# EAGLE design pcbremote (EAGLE 9.6.2)
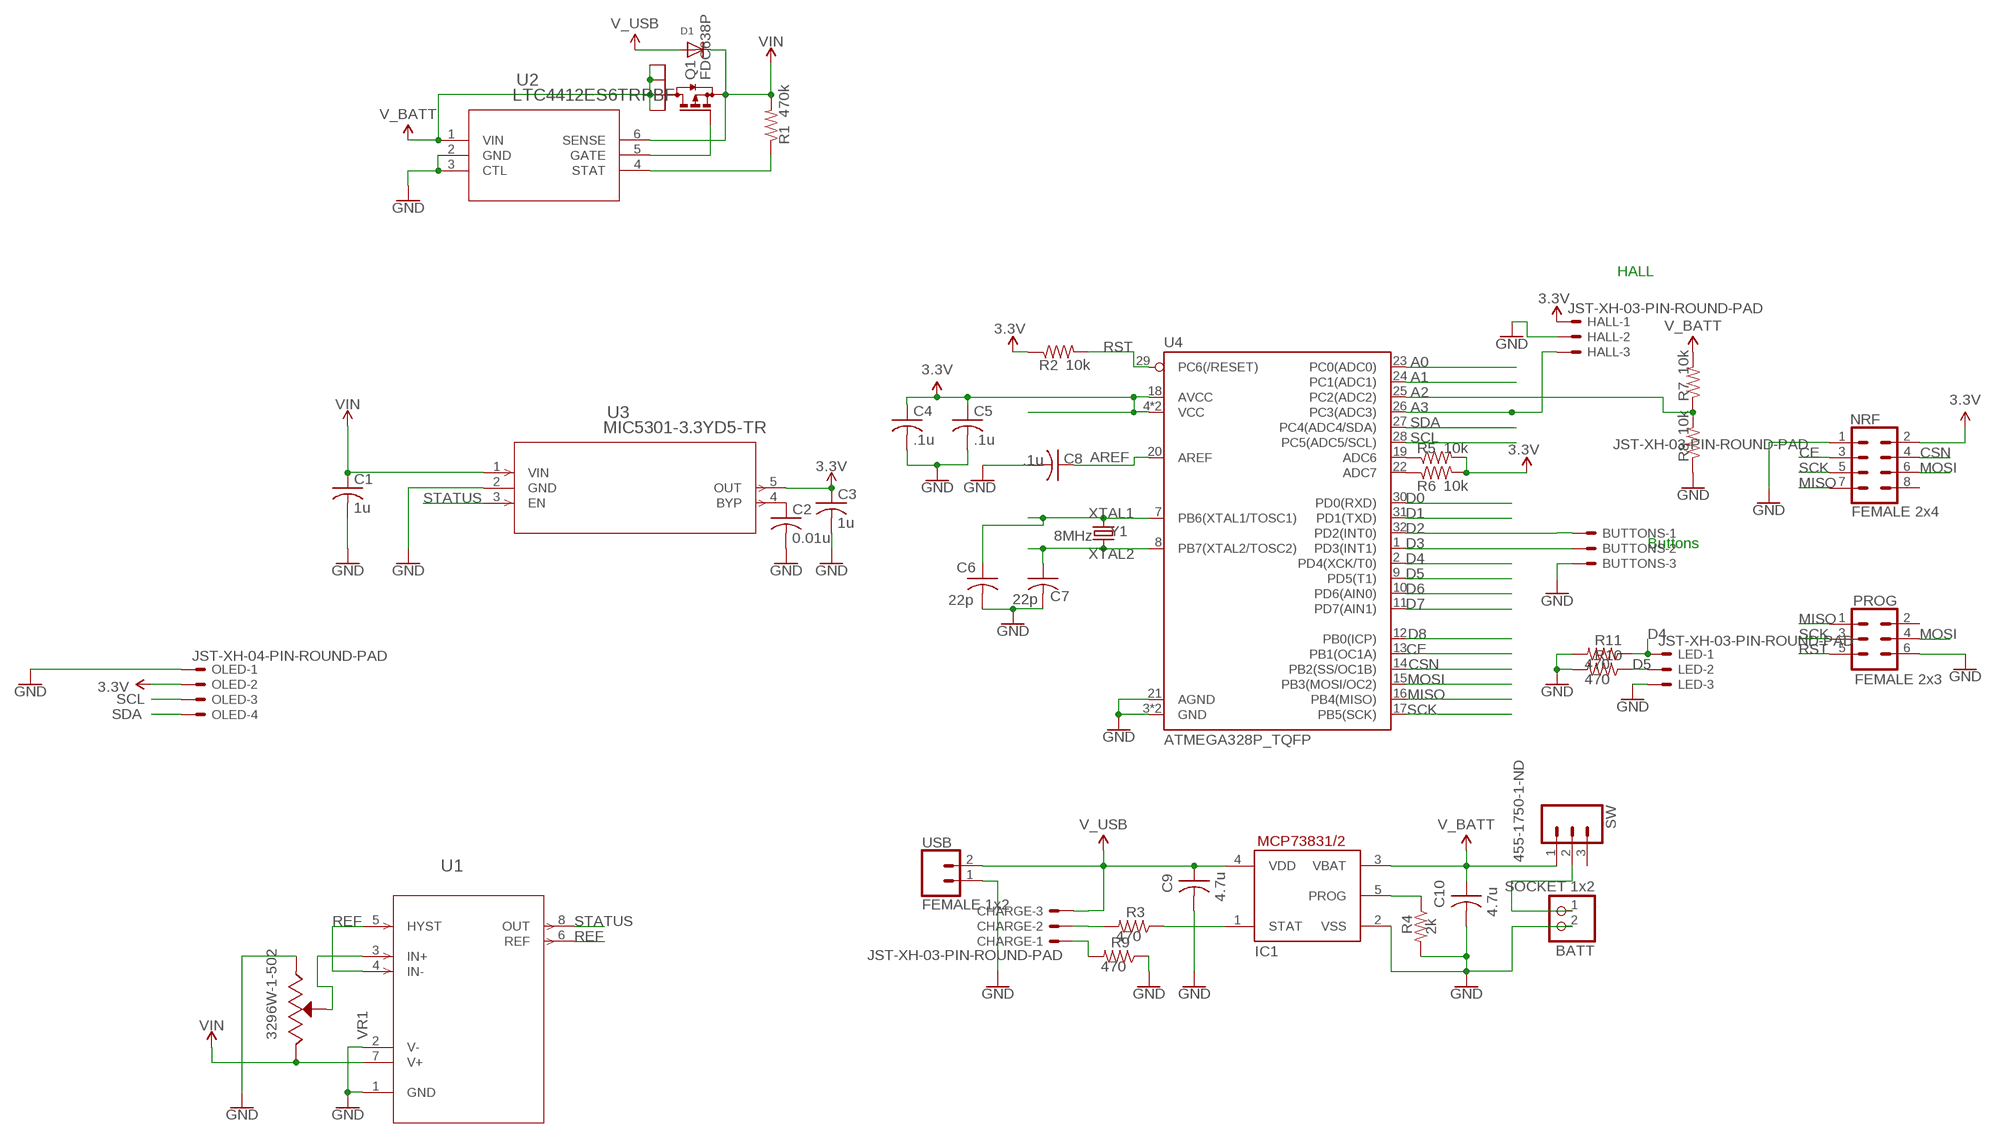
[diagram p0: schematic, sheet 1]

## Parts
BATT  SOCKET 1x2  JST_2PIN-THM  [JST-PH-2-THM]
BUTTONS  JST-XH-03-PIN-ROUND-PAD  [JST-XH-03-PACKAGE-ROUND-PAD]
C1  1u  C-USC0805  [C0805]
C2  0.01u  C-USC0805  [C0805]
C3  1u  C-USC0805  [C0805]
C4  .1u  C-USC0805  [C0805]
C5  .1u  C-USC0805  [C0805]
C6  22p  C-USC0805  [C0805]
C7  22p  C-USC0805  [C0805]
C8  .1u  C-USC0805  [C0805]
C9  4.7u  C-USC0805  [C0805]
C10  4.7u  C-USC0805  [C0805]
CHARGE  JST-XH-03-PIN-ROUND-PAD  [JST-XH-03-PACKAGE-ROUND-PAD]
D1  DIODESOD-123  [SOD-123]
HALL  JST-XH-03-PIN-ROUND-PAD  [JST-XH-03-PACKAGE-ROUND-PAD]
IC1  MCP73831/OT  [SOT23-5L]
LED  JST-XH-03-PIN-ROUND-PAD  [JST-XH-03-PACKAGE-ROUND-PAD]
NRF  FEMALE 2x4  CONN_04X2  [2X4]
OLED  JST-XH-04-PIN-ROUND-PAD  [JST-XH-04-PACKAGE-ROUND-PAD]
PROG  FEMALE 2x3  CONN_03X2FEMALE  [2X3]
Q1  FDC638P  [SSOT-6]
R1  470k  R-US_R0805  [R0805]
R2  10k  R-US_R0805  [R0805]
R3  470  R-US_R0805  [R0805]
R4  2k  R-US_R0805  [R0805]
R5  10k  R-US_R0805  [R0805]
R6  10k  R-US_R0805  [R0805]
R7  10k  R-US_R0805  [R0805]
R8  10k  R-US_R0805  [R0805]
R9  470  R-US_R0805  [R0805]
R10  470  R-US_R0805  [R0805]
R11  470  R-US_R0805  [R0805]
SW  455-1750-1-ND  CONN_03  [1X03]
U1  LTC1540CS8PBF  [SO-8_S_LIT]
U2  LTC4412ES6TRPBF  [TSOT-23_S6_LIT]
U3  MIC5301-3.3YD5-TR  [TSOT-23-5_D5_MCH]
U4  ATMEGA328P_TQFP  [TQFP32-08]
USB  FEMALE 1x2  CONN_02  [1X02]
VR1  3296W-1-502  [TRIM_3296W-1-502]
Y1  8MHz  CRYSTAL-8MHZSMD-5X3.2  [CRYSTAL-SMD-5X3.2-4PAD]

## Nets
3.3V: C3.1 C4.1 C5.1 HALL.1 NRF.2 OLED.2 R2.1 R5.2 R6.2 U3.5(OUT) U4.4(VCC) U4.6(VCC) U4.18(AVCC)
A0: U4.23(PC0(ADC0))
A1: U4.24(PC1(ADC1))
A2: R7.1 R8.2 U4.25(PC2(ADC2))
A3: HALL.3 U4.26(PC3(ADC3))
AREF: C8.1 U4.20(AREF)
CE: NRF.3 U4.13(PB1(OC1A))
CSN: NRF.4 U4.14(PB2(SS/OC1B))
D0: U4.30(PD0(RXD))
D1: U4.31(PD1(TXD))
D2: BUTTONS.1 U4.32(PD2(INT0))
D3: BUTTONS.2 U4.1(PD3(INT1))
D4: LED.1 R11.1 U4.2(PD4(XCK/T0))
D5: LED.2 R10.1 U4.9(PD5(T1))
D6: U4.10(PD6(AIN0))
D7: U4.11(PD7(AIN1))
D8: U4.12(PB0(ICP))
GND: BATT.2 BUTTONS.3 C1.2 C2.2 C3.2 C4.2 C5.2 C6.2 C7.2 C8.2 C9.2 C10.2 HALL.2 IC1.2(VSS) LED.3 NRF.1 OLED.1 PROG.6 R4.2 R8.1 R9.1 R10.2 R11.2 U1.1(GND) U1.2(V-) U2.2(GND) U2.3(CTL) U3.2(GND) U4.3(GND) U4.5(GND) U4.21(AGND) USB.1 VR1.3(CW)
MISO: NRF.7 PROG.1 U4.16(PB4(MISO))
MOSI: NRF.6 PROG.4 U4.15(PB3(MOSI/OC2))
N$1: U1.3(IN+) VR1.2(WIPER)
N$2: CHARGE.1 R9.2
N$3: IC1.5(PROG) R4.1
N$4: IC1.1(STAT) R3.1
N$5: CHARGE.2 R3.2
N$6: R5.1 U4.19(ADC6)
N$7: R6.1 U4.22(ADC7)
N$8: C2.1 U3.4(BYP)
N$9: Q1.3(G) U2.5(GATE)
N$10: BATT.1 SW.2
N$13: R1.1 U2.4(STAT)
REF: U1.4(IN-) U1.5(HYST) U1.6(REF)
RST: PROG.5 R2.2 U4.29(PC6(/RESET))
SCK: NRF.5 PROG.3 U4.17(PB5(SCK))
SCL: OLED.3 U4.28(PC5(ADC5/SCL))
SDA: OLED.4 U4.27(PC4(ADC4/SDA))
STATUS: U1.8(OUT) U3.3(EN)
V_BATT: C10.1 IC1.3(VBAT) Q1.1(D4) Q1.2(D1) Q1.5(D2) Q1.6(D3) R7.2 SW.1 U2.1(VIN)
V_USB: C9.1 CHARGE.3 D1.A IC1.4(VDD) USB.2
VIN: C1.1 D1.C Q1.4(S) R1.2 U1.7(V+) U2.6(SENSE) U3.1(VIN) VR1.1(CCW)
XTAL1: C6.1 U4.7(PB6(XTAL1/TOSC1)) Y1.1
XTAL2: C7.1 U4.8(PB7(XTAL2/TOSC2)) Y1.3
Unconnected: NRF.8 PROG.2 SW.3

## Notes on the sheet
- HALL
- Buttons

## Library data of the parts
BATT = adafruit:JST_2PIN: JST 2-Pin Connectors of various flavors SMT-RA (S2B-PH-SM4) 4UConnector #17311 SMT (B2B-PH-SM4) THM-RA (S2B-PH) THM (B2B-PH)
BUTTONS CHARGE HALL LED = Rembrandt Electronics - JST XH Connectors v1-0:JST-XH-03-PIN: JST XH Connector 2 Pin Wire to board connector. Pitch: 2,54 mm, (0.100") Number of pins: 3 Created by Rembrandt Electronics www.rembrandtelectronics.com
C1-C10 = rcl:C-US: CAPACITOR, American symbol; SPICEPREFIX: C
D1 = adafruit:DIODE: Diode SMADIODE - SMA Surface Mount Package 20V 1A Schottky Diode Digikey: 641-1014-6-ND DO-1N4148 - Through Hole Small Current Diode SOD-123 20V 1 A (.5mV Vf) Schottky Diode - Digikey: MBRX120TPMSCT-ND SOD-323 10V 570mA (.38mV Vf, 3ns) Schottky Diode - Digikey: ZLLS410CT-ND SOD-523 30V 30mA Schottky Diode (RB751S-40TE61) - Digikey: RB751S-40TE61CT-ND SOT23-R/W - SOT23 Package (R = Solder Paste/Reflow Ovens, W = Hand-Soldering) BAT54Film 40V 300mA - Digikey: 497-7162-1-ND
IC1 = adafruit:MCP73831: MCP73831/2 Miniature Single-Cell, Fully Integrated Li-Ion, Li-Polymer Charge Management Controllers. Nice and small simple lipoly charge controller, with adjustable current and status output (LED) http://www.ladyada.net/library/pcb/eaglelibrary.html
NRF = SparkFun-Connectors:CONN_04X2: Multi connection point. Often used as Generic Header-pin footprint for 0.1 inch spaced/style header connections On any of the 0.1 inch spaced packages, you can populate with these: Break Away Headers - Straight <https://www.sparkfun.com/products/116> (PRT-00116) Break Away Male Headers - Right Angle <https://www.sparkfun.com/products/553> (PRT-00553) Female Headers <https://www.sparkfun.com/products/115> (PRT-00115) Break Away Headers - Machine Pin <https://www.sparkfun.com/products/117> (PRT-00117) Break Away Female Headers - Swiss Machine Pin <https://www.sparkfun.com/products/743> (PRT-00743)
OLED = Rembrandt Electronics - JST XH Connectors v1-0:JST-XH-04-PIN: JST XH Connector 2 Pin Wire to board connector. Pitch: 2,54 mm, (0.100") Number of pins: 4 Created by Rembrandt Electronics www.rembrandtelectronics.com
PROG = SparkFun-Connectors:CONN_03X2: Multi connection point. Often used as Generic Header-pin footprint for 0.1 inch spaced/style header connections You can populate with any combo of single row headers, but if you'd like an exact match, check these: Header - 2x3 (Male, 0.1") <https://www.sparkfun.com/products/12807> (PRT-12807) Header - 2x3 (Female, 0.1") <https://www.sparkfun.com/products/13010> (PRT-13010) 2x3 Pin Shrouded Header <https://www.sparkfun.com/products/10877> (PRT-10877) On any of the 0.1 inch spaced packages, you can populate with these: Break Away Headers - Straight <https://www.sparkfun.com/products/116> (PRT-00116) Break Away Male Headers - Right Angle <https://www.sparkfun.com/products/553> (PRT-00553) Female Headers <https://www.sparkfun.com/products/115> (PRT-00115) Break Away Headers - Machine Pin <https://www.sparkfun.com/products/117> (PRT-00117) Break Away Female Headers - Swiss Machine Pin <https://www.sparkfun.com/products/743> (PRT-00743) Special note: the shrouded connector mates well with our 3x2 ribbon cables: Ribbon Crimp Connector - 6-pin (2x3, Female) <https://www.sparkfun.com/products/10651> (PRT-10651) Ribbon Cable - 6 wire (15ft) <https://www.sparkfun.com/products/10646> (PRT-10646); PROD_ID: CONN-11566
Q1 = FDC638P:FDC638P; DESCRIPTION: P-Channel 20V 4.5A (Ta) 1.6W (Ta) Surface Mount SuperSOT™-6; DIGI-KEY_PART_NUMBER: FDC638PCT-ND; MF: ON Semiconductor; MP: FDC638P; PACKAGE: TSOT-23-6 ON Semiconductor
R1-R11 = rcl:R-US_: RESISTOR, American symbol; SPICEPREFIX: R
SW = SparkFun-Connectors:CONN_03: Multi connection point. Often used as Generic Header-pin footprint for 0.1 inch spaced/style header connections On any of the 0.1 inch spaced packages, you can populate with these: Break Away Headers - Straight <https://www.sparkfun.com/products/116> (PRT-00116) Break Away Male Headers - Right Angle <https://www.sparkfun.com/products/553> (PRT-00553) Female Headers <https://www.sparkfun.com/products/115> (PRT-00115) Break Away Headers - Machine Pin <https://www.sparkfun.com/products/117> (PRT-00117) Break Away Female Headers - Swiss Machine Pin <https://www.sparkfun.com/products/743> (PRT-00743) Stackable Header - 3 Pin (Female, 0.1") <https://www.sparkfun.com/products/13875> (PRT-13875) For SCREWTERMINALS and SPRING TERMINALS visit here: Screw Terimnals on SparkFun.com <https://www.sparkfun.com/search/results?term=Screw+Terminals> (5mm/3.5mm/2.54mm spacing) This device is also useful as a general connection point to wire up your design to another part of your project. Our various solder wires solder well into these plated through hole pads. Hook-Up Wire - Assortment (Stranded, 22 AWG) <https://www.sparkfun.com/products/11375> (PRT-11375) Hook-Up Wire - Assortment (Solid Core, 22 AWG) <https://www.sparkfun.com/products/11367> (PRT-11367) View the entire wire category on our website here <https://www.sparkfun.com/categories/141> Special notes: Molex polarized connector foot print use with SKU : PRT-08232 with associated crimp pins and housings.; PROD_ID: XXX-00000
U1 = LTC_1450:LTC1540CS8PBF; BUILT_BY: EMA_UL_Team; MANUFACTURER_PART_NUMBER: ltc1540cs8#pbf; SOURCELIBRARY: LinearTech_2016_03_08; VENDOR: Linear Technology
U2 = LTC4412:LTC4412ES6TRPBF; BUILT_BY: EMA_UL_Team; MANUFACTURER_PART_NUMBER: LTC4412ES6#TRPBF; SOURCELIBRARY: LinearTech_2016-05-13_1; VENDOR: Linear Technology
U3 = MIC5301:MIC5301-3.3YD5-TR; BUILT_BY: EMA_Jessica; COPYRIGHT: Copyright (C) 2018 Accelerated Designs. All rights reserved; MANUFACTURER_PART_NUMBER: MIC5301-3.3YD5-TR; SOURCELIBRARY: Microchip_2019-08-23_3; VENDOR: Microchip
U4 = SparkFun-IC-Microcontroller:ATMEGA328P_TQFP: Popular 328P in QFP Storefront component: ATmega328 - TQFP <https://www.sparkfun.com/products/13448> (COM-13448) Datasheet <http://www.sparkfun.com/datasheets/Components/SMD/ATMega328.pdf> SparkFun Products SparkFun RedBoard - Programmed with Arduino <https://www.sparkfun.com/products/12757> (DEV-12757) Arduino Pro Mini 328 - 5V/16MHz <https://www.sparkfun.com/products/11113> (DEV-11113) Arduino Pro Mini 328 - 3.3V/8MHz <https://www.sparkfun.com/products/11114> (DEV-11114) SparkFun OpenLog <https://www.sparkfun.com/products/13712> (DEV-13712) SparkFun MicroView - OLED Arduino Module <https://www.sparkfun.com/products/12923> (DEV-12923) SparkFun Digital Sandbox <https://www.sparkfun.com/products/12651> (DEV-12651) SparkFun PicoBoard <https://www.sparkfun.com/products/11888> (WIG-11888) Arduino Fio <https://www.sparkfun.com/products/10116> (DEV-10116) LilyPad Arduino 328 Main Board <https://www.sparkfun.com/products/13342> (DEV-13342) SparkFun RedStick <https://www.sparkfun.com/products/13741> (DEV-13741) LilyPad MP3 <https://www.sparkfun.com/products/11013> (DEV-11013) LilyPad Arduino SimpleSnap <https://www.sparkfun.com/products/10941> (DEV-10941) SparkFun Stepoko <https://www.sparkfun.com/products/13899> (ROB-13899) SparkFun Geiger Counter <https://www.sparkfun.com/products/11345> (SEN-11345) SparkFun EL Sequencer <https://www.sparkfun.com/products/12781> (COM-12781) Arduino Pro 328 - 5V/16MHz <https://www.sparkfun.com/products/10915> (DEV-10915) CryptoCape <https://www.sparkfun.com/products/12773> (DEV-12773) SparkFun IR Thermometer Evaluation Board - MLX90614 <https://www.sparkfun.com/products/10740> (SEN-10740) SparkFun RedBot Mainboard <https://www.sparkfun.com/products/12097> (ROB-12097) Arduino Pro 328 - 3.3V/8MHz <https://www.sparkfun.com/products/10914> (DEV-10914) SparkFun Block for Intel® Edison - Arduino <https://www.sparkfun.com/products/13036> (DEV-13036) SparkFun Simon Says - Surface Mount Soldering Kit <https://www.sparkfun.com/products/10935> (KIT-10935) SparkFun 7-Segment Serial Display - Red <https://www.sparkfun.com/products/11441> (COM-11441) SparkFun 7-Segment Serial Display - White <https://www.sparkfun.com/products/11629> (COM-11629) SparkFun 7-Segment Serial Display - Yellow <https://www.sparkfun.com/products/11443> (COM-11443) SparkFun 7-Segment Serial Display - Kelly Green <https://www.sparkfun.com/products/11440> (COM-11440) SparkFun 7-Segment Serial Display - Blue <https://www.sparkfun.com/products/11442> (COM-11442) SparkFun OpenSegment Serial Display - 20mm (Blue) <https://www.sparkfun.com/products/11647> (COM-11647) SparkFun OpenSegment Serial Display - 20mm (Green) <https://www.sparkfun.com/products/11646> (COM-11646) SparkFun OpenSegment Serial Display - 20mm (White) <https://www.sparkfun.com/products/11648> (COM-11648) SparkFun OpenSegment Serial Display - 20mm (Red) <https://www.sparkfun.com/products/11644> (COM-11644) SparkFun OpenSegment Serial Display - 20mm (Yellow) <https://www.sparkfun.com/products/11645> (COM-11645) SparkFun OpenSegment Shield <https://www.sparkfun.com/products/13190> (DEV-13190); PROD_ID: IC-09069
USB = SparkFun-Retired:CONN_02: Multi connection point. Often used as Generic Header-pin footprint for 0.1 inch spaced/style header connections On any of the 0.1 inch spaced packages, you can populate with these: Break Away Headers - Straight <https://www.sparkfun.com/products/116> (PRT-00116) Break Away Male Headers - Right Angle <https://www.sparkfun.com/products/553> (PRT-00553) Female Headers <https://www.sparkfun.com/products/115> (PRT-00115) Break Away Headers - Machine Pin <https://www.sparkfun.com/products/117> (PRT-00117) Break Away Female Headers - Swiss Machine Pin <https://www.sparkfun.com/products/743> (PRT-00743) For SCREWTERMINALS and SPRING TERMINALS visit here: Screw Terimnals on SparkFun.com <https://www.sparkfun.com/search/results?term=Screw+Terminals> (5mm/3.5mm/2.54mm spacing) This device is also useful as a general connection point to wire up your design to another part of your project. Our various solder wires solder well into these plated through hole pads. Hook-Up Wire - Assortment (Stranded, 22 AWG) <https://www.sparkfun.com/products/11375> (PRT-11375) Hook-Up Wire - Assortment (Solid Core, 22 AWG) <https://www.sparkfun.com/products/11367> (PRT-11367) View the entire wire category on our website here <https://www.sparkfun.com/categories/141> Special notes: Molex polarized connector foot print use with: PRT-08233 with associated crimp pins and housings. 2.54_SCREWTERM for use with PRT-10571. 3.5mm Screw Terminal footprints for PRT-08084 5mm Screw Terminal footprints for use with PRT-08432
VR1 = 3296W-1-502:3296W-1-502: Res Cermet Trimmer 500K Ohm 10% 0.5W 25(Elec)Turn 2.19mm (9.53 X 4.83 X 11.55mm) Pin Thru-Hole Tube; DESCRIPTION: 5 kOhms 0.5W, 1/2W PC Pins Through Hole Trimmer Potentiometer Cermet 25 Turn Top Adjustment; DIGI-KEY_PART_NUMBER: 3296W-502LF-ND; MF: Bourns; MP: 3296W-1-502; PACKAGE: SOT-23-5 Bourns; PURCHASE-URL: https://pricing.snapeda.com/search/part/3296W-1-502/?ref=eda
Y1 = SparkFun-Clocks:CRYSTAL-8MHZ: 8MHz Crystal Datasheet Example <http://www.futureelectronics.com/en/technologies/electromechanical/timing-devices/crystals/Pages/6008189-ABM3B-8.000MHZ-B2-T.aspx?IM=0> Frequency: 8MHz Frequency Tolerance: ±20ppm Load Capacitance: 18pF SparkFun Products: Pro Micro -3.3V/8MHz <https://www.sparkfun.com/products/12587> WAV Trigger <https://www.sparkfun.com/products/13660>; PROD_ID: XTAL-09431

## Board
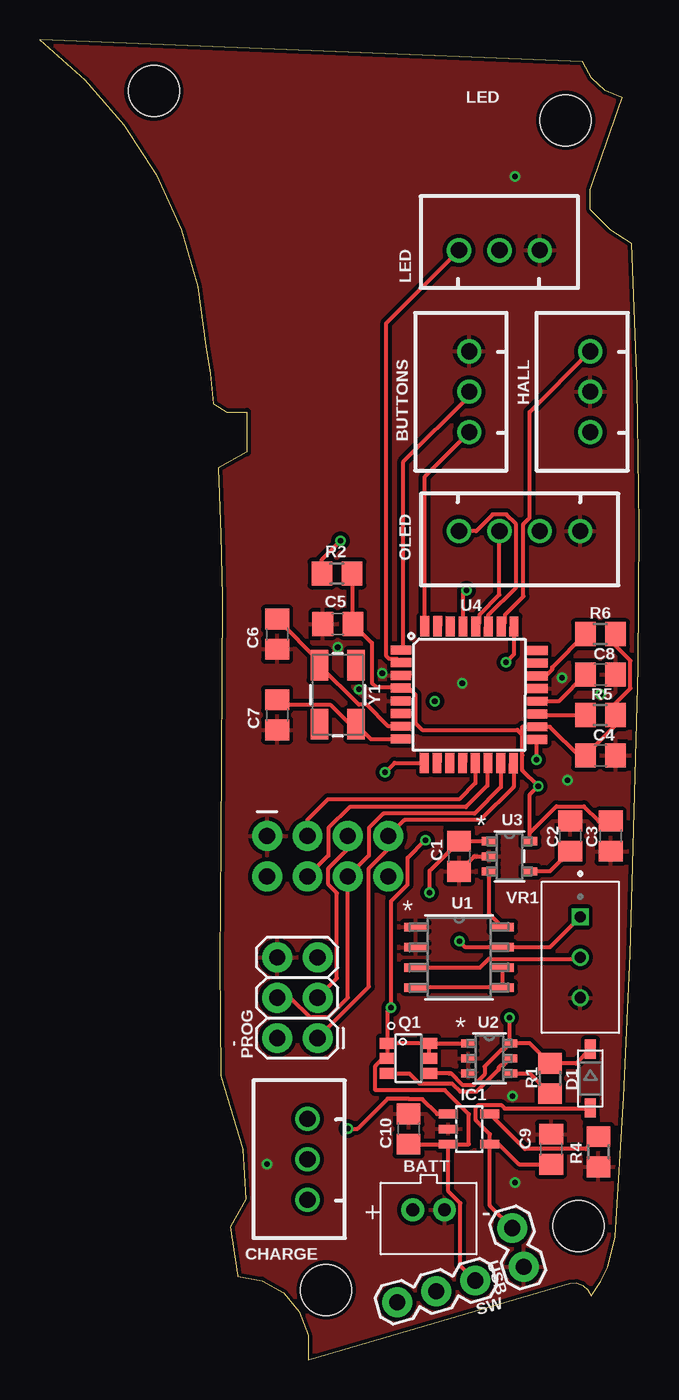
[diagram p1: board, top side]
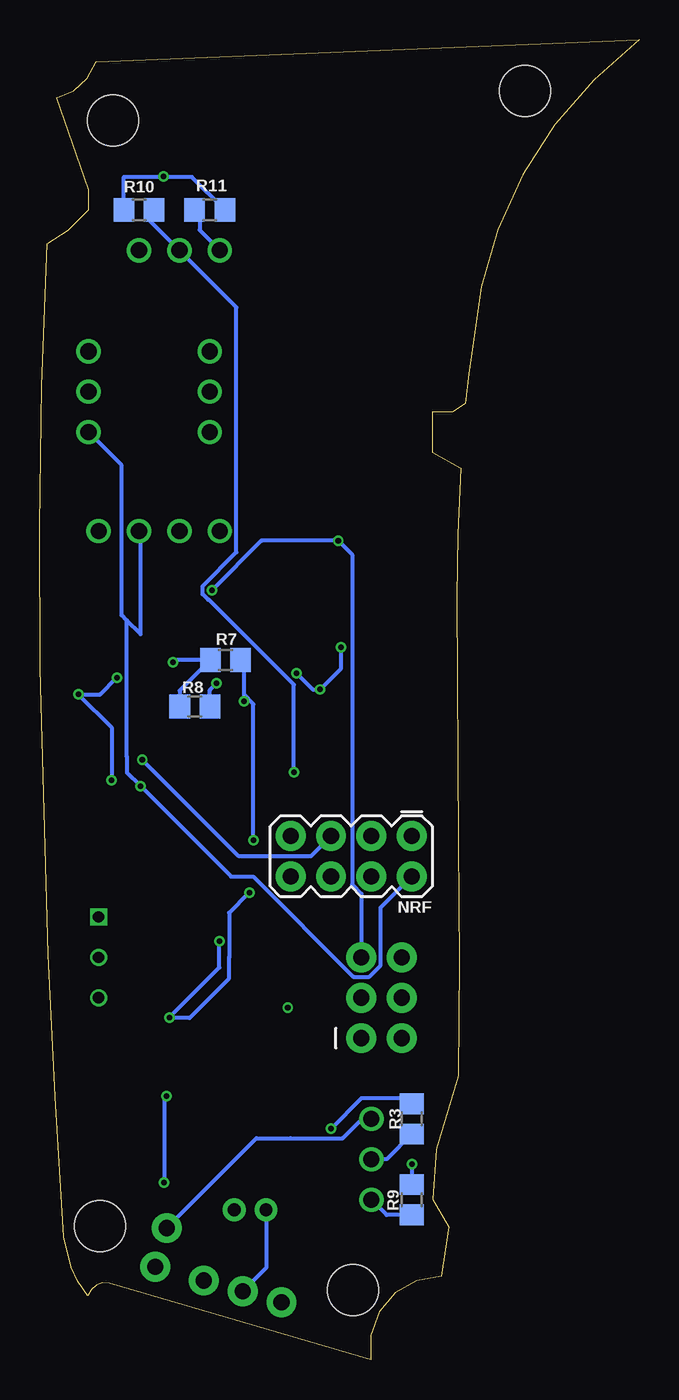
[diagram p2: board, bottom side, seen from below]

Size 37.67 x 82.99 mm. Coordinates in mm from the lower left corner, seen from the top.
Outline: 34.13,81.6 0,82.99 2.83,80.47 5.29,77.64 7.32,74.49 8.88,71.06 9.91,67.46 10.44,63.74 10.7,62 10.92,60.11 11.74,59.59 13.01,59.59 13.01,58.32 13.01,57.05 11.22,56.04 11.39,51.87 11.46,47.94 11.37,32.54 11.3,25 11.37,17.86 12.76,13.24 12.95,10.07 11.97,8.37 12.44,5.24 12.44,5.24 13.97,4.97 15.32,4.2 16.32,3.01 16.86,1.55 16.88,0 33.31,4.8 33.73,4.83 34.12,4.68 34.42,4.39 34.66,4.03 35.27,4.92 35.7,5.81 36.17,7.74 36.69,16.54 37.12,25.47 37.63,43.47 37.67,52.4 37.54,61.2 37.2,70.17 35.87,71.02 34.6,72.29 34.6,73.56 36.6,79.34 35.54,79.8 34.68,80.58 34.13,81.6
Copper layers (1*16): Top 0.035mm / dielectric 1.5mm / Bottom 0.035mm
Design rules "PCBWay_2layer": minimum track width 6mil, minimum drill 0.3mm, track to track 6mil, track to pad 6mil, pad to pad 6mil, via to via 6mil, smd to smd 4mil, copper to edge 10mil, drill to drill 6mil, minimum pad ring 6mil, minimum via ring 6mil, stop-mask expansion 4mil, vias tented up to drill 0.8mm, thermal gap 10mil
Holes 3.2 mm at 17.99,4.4 33.05,77.93 7.17,79.76 33.87,8.41

### Footprints (pad centres in the part's own frame; a part is rotated, then mirrored left to right if it is on the bottom)
JST-PH-2-THM = drill 0.8 pad 1.422: 1 1,0; 2 -1,0
JST-XH-03-PACKAGE-ROUND-PAD = drill 1.016: 1 -2.54,0; 2 0,0; 3 2.54,0
C0805 = smd 1.3 x 1.5: 1 -0.95,0; 2 0.95,0
SOD-123 = smd 1.2 x 0.7: A 1.85,0; C -1.85,0
SOT23-5L = smd 0.55 x 1.2: 1 -0.95,-1.3; 2 0,-1.3; 3 0.95,-1.3; 4 0.95,1.3; 5 -0.95,1.3
2X4 = drill 1.016 pad 1.88: 1 -3.81,-1.27; 2 -3.81,1.27; 3 -1.27,-1.27; 4 -1.27,1.27; 5 1.27,-1.27; 6 1.27,1.27; 7 3.81,-1.27; 8 3.81,1.27
JST-XH-04-PACKAGE-ROUND-PAD = drill 1.016: 1 -3.81,0; 2 -1.27,0; 3 1.27,0; 4 3.81,0
2X3 = drill 1.016 pad 1.88: 1 0,0; 2 0,2.54; 3 2.54,0; 4 2.54,2.54; 5 5.08,0; 6 5.08,2.54
SSOT-6 = smd 0.7 x 1: 1 -0.95,-1.3; 2 0,-1.3; 3 0.95,-1.3; 4 0.95,1.3; 5 0,1.3; 6 -0.95,1.3
R0805 = smd 1.3 x 1.5: 1 -0.95,0; 2 0.95,0
1X03 = drill 1.016 pad 1.88: 1 0,0; 2 2.54,0; 3 5.08,0
SO-8_S_LIT = smd 1.46 x 0.533: 1 -2.724,1.905; 2 -2.724,0.635; 3 -2.724,-0.635; 4 -2.724,-1.905; 5 2.724,-1.905; 6 2.724,-0.635; 7 2.724,0.635; 8 2.724,1.905
TSOT-23_S6_LIT = smd 0.876 x 0.508: 1 -1.314,0.95; 2 -1.314,0; 3 -1.314,-0.95; 4 1.314,-0.95; 5 1.314,0; 6 1.314,0.95
TSOT-23-5_D5_MCH = smd 0.953 x 0.508: 1 -1.276,0.95; 2 -1.276,0; 3 -1.276,-0.95; 4 1.276,-0.95; 5 1.276,0.95
TQFP32-08 = smd 1.27 x 0.559: 1 -4.293,2.8; 2 -4.293,2; 3 -4.293,1.2; 4 -4.293,0.4; 5 -4.293,-0.4; 6 -4.293,-1.2; 7 -4.293,-2; 8 -4.293,-2.8; 17 4.293,-2.8; 18 4.293,-2; 19 4.293,-1.2; 20 4.293,-0.4; 21 4.293,0.4; 22 4.293,1.2; 23 4.293,2; 24 4.293,2.8 | smd 0.559 x 1.27: 9 -2.8,-4.293; 10 -2,-4.293; 11 -1.2,-4.293; 12 -0.4,-4.293; 13 0.4,-4.293; 14 1.2,-4.293; 15 2,-4.293; 16 2.8,-4.293; 25 2.8,4.293; 26 2,4.293; 27 1.2,4.293; 28 0.4,4.293; 29 -0.4,4.293; 30 -1.2,4.293; 31 -2,4.293; 32 -2.8,4.293
1X02 = drill 1.016 pad 1.88: 1 0,0; 2 2.54,0
TRIM_3296W-1-502 = drill 0.71 square: 1 -2.54,0 | drill 0.71: 2 0,0; 3 2.54,0
CRYSTAL-SMD-5X3.2-4PAD = smd 1.9 x 1.1: 1 -1.85,-1.15; 2 1.85,-1.15; 3 1.85,1.15; 4 -1.85,1.15

### Placement (x,y rotation side)
BATT  24.44,9.43 180 top
BUTTONS  26.98,60.86 90 top
C1  26.35,31.65 270 top
C2  33.33,32.92 90 top
C3  35.87,32.92 270 top
C4  35.24,38 0 top
C5  18.73,46.26 180 top
C6  14.92,45.62 270 top
C7  14.92,40.54 270 top
C8  35.24,43.08 0 top
C9  32.14,13.24 90 top
C10  23.17,14.51 90 top
CHARGE  16.82,12.6 90 top
D1  34.6,17.68 270 top
HALL  34.6,60.86 90 top
IC1  26.98,14.51 270 top
LED  28.89,69.75 0 top
NRF  18.09,31.65 180 bottom
OLED  30.16,52.1 180 top
PROG  17.46,20.22 90 top
Q1  23.17,18.95 270 top
R1  32.06,17.68 90 top
R2  18.68,49.43 180 top
R3  14.28,15.14 270 bottom
R4  35.11,13.08 270 top
R5  35.24,40.54 0 top
R6  35.24,45.62 0 top
R7  25.99,43.99 0 bottom
R8  27.92,41.07 180 bottom
R9  14.28,10.06 270 bottom
R10  31.43,72.29 180 bottom
R11  26.98,72.29 0 bottom
SW  27.36,4.98 195.6 top
U1  26.35,25.3 0 top
U2  28.25,18.95 0 top
U3  29.52,31.65 0 top
U4  26.98,41.81 359.8 top
USB  30.41,5.84 106.5 top
VR1  33.97,25.3 270 top
Y1  18.73,41.81 270 top

### Tracks (layer width: path | path; a pad name or v marks a point on that pad's centre or on a via)
3.3V  (via drill 0.35)
  Top 0.254: 23.6,40.86 23.61,41.82 23.16,42.26 22.73,42.26 U4.4 22.63,42.29 21.13,42.29 20.86,42.56 20.86,45.07 C5.1 19.63,46.31 R2.1 | 23.6,40.86 23.6,40.54 | 23.6,40.54 23.6,40.3 | 23.6,40.86 23.28,40.54 22.77,40.54 U4.6 | U4.18 32.06,39.8 33.86,38 C4.1 36.19,39.9 R5.2 36.19,41.29 37.12,42.21 37.12,43.95 36.19,44.88 R6.2 | C3.1 35.13,33.87 34.2,34.8 32.47,34.8 30.8,33.13 U3.5 30.8,35.54 v31.33,36.07 30.34,37.06 30.34,38 30.34,39.27 | U4.18 31.33,39.74 | 30.34,39.27 30.34,39.8 31.26,39.8 U4.18 | 30.34,39.27 30.01,39.59 24.03,39.59 23.6,40.02 23.6,40.54
  Bottom 0.254: 32.19,46.48 32.19,37.9 32.19,36.93 v31.33,36.07 25.64,30.38 24.26,30.38 17.96,24.08 16.95,24.08 16.24,24.8 16.24,28.42 NRF.2 | OLED.2 31.33,52 31.33,45.62 32.19,46.48 | 32.19,46.48 32.52,46.81 32.52,56.24 HALL.1
A2  (via drill 0.35)
  Top 0.254: U4.25 29.8,44.35 v29.29,43.84
  Bottom 0.254: R8.2 28.87,42.06 R7.1 29.14,43.99 v29.29,43.84
A3
  Top 0.254: U4.26 29.24,46.34 29.24,46.84 30.39,47.99 30.39,52.53 30.79,52.94 30.79,59.59 HALL.3
AREF
  Top 0.254: C8.1 32.6,41.4 U4.20
CE
  Top 0.254: U4.13 27.38,37.5 27.38,36.26 26.35,35.23 18.11,35.23 16.82,33.95 NRF.3
CSN
  Top 0.254: U4.14 28.13,37.47 28.13,36.1 26.78,34.75 19.47,34.75 18.14,33.43 18.14,31.7 NRF.4
D2
  Top 0.254: U4.32 24.2,55.54 BUTTONS.1
D3
  Top 0.254: BUTTONS.2 26.98,60.58 22.83,56.42 22.83,44.75 U4.1
D4
  Top 0.254: U4.2 22.46,44.07 21.95,44.07 21.78,44.23 21.78,65.19 LED.1
  Bottom 0.254: LED.1 27.62,71.02 27.62,72.29 R11.1
D5  (via drill 0.35)
  Top 0.254: v21.7,36.93 22.29,37.53 U4.9
  Bottom 0.254: LED.2 29.21,70.07 | 29.21,70.07 30.79,71.66 30.79,72.29 R10.1 | v21.7,36.93 21.7,42.45 27.04,47.78 27.08,47.78 27.44,48.14 27.44,48.64 25.31,50.77 25.31,66.17 29.21,70.07
GND  (via drill 0.35)
  Top 0.254: C1.2 27.3,31.65 U3.2
  Bottom 0.254: v32.83,42.88 33.87,41.84 v35.24,41.84 33.16,39.75 v33.16,36.43 | R10.2 32.38,74.36 29.84,74.36 | 29.84,74.36 v29.88,74.4 | R11.2 28.1,74.36 29.84,74.36 | R8.1 26.97,42.1 v26.55,42.52 | v29.7,16.56 29.85,16.41 v29.85,11.13 | v21.52,43.16 20.51,42.14 v20.05,42.14 18.73,43.46 v18.73,44.78 | v14.28,12.3 R9.1
  pour Top (isolate 0.254): 0.31,83.72 34.6,82.45 35.87,81.18 38.41,78.64 38.41,6.25 34.6,2.44 33.33,3.71 16.82,-1.37 15.55,1.17 14.28,3.71 11.74,3.71 11.74,4.98 9.2,25.3 9.2,51.97 9.2,59.59 7.93,68.48 4.12,74.83 1.58,78.64 -0.96,82.45 -2.23,83.72
MISO
  Top 0.254: U4.16 29.78,37.5 29.78,36.02 27.69,33.94 22.92,33.94 NRF.7 21.9,32.1 20.68,30.89 20.68,23.45 PROG.1
MOSI
  Top 0.254: U4.15 28.98,37.5 28.98,36 27.32,34.34 21.6,34.34 20.68,33.43 20.68,31.7 NRF.6 19.36,22.76 18.09,21.49 18.04,21.54 16.95,21.54 15.73,22.76 PROG.4
N$1
  Top 0.254: U1.3 27.68,24.67 28.23,25.21 33.88,25.21 VR1.2
N$2
  Bottom 0.254: R9.2 15.87,9.11 CHARGE.1
N$3
  Top 0.254: IC1.5 30.49,13.25 34.32,13.25 R4.1
N$4  (via drill 0.35)
  Top 0.254: v19.36,14.53 19.97,14.53 19.98,14.53 21.86,16.41 23.17,16.41 23.2,16.38 24.04,16.38 24.97,15.46 IC1.1
  Bottom 0.254: v19.36,14.53 17.43,16.46 14.65,16.46 R3.1
N$5
  Bottom 0.254: R3.2 15.87,12.6 CHARGE.2
N$6
  Top 0.254: U4.19 31.33,40.54 R5.1
N$7
  Top 0.254: R6.1 32.2,43.53 32.2,43.4 31.79,43 U4.22
N$8
  Top 0.254: C2.1 32.06,30.7 U3.4
N$9
  Top 0.254: U2.5 29.15,18.53 29.01,18.53 28.85,18.37 28.85,18.25 27.46,16.86 26.42,16.86 25.91,17.37 23.86,17.37 23.23,18 Q1.3
N$10
  Bottom 0.254: BATT.1 23.44,5.77 SW.2
N$13
  Top 0.254: U2.4 30.79,18 R1.1
REF
  Top 0.254: U1.6 U1.5 U1.4
RST  (via drill 0.35)
  Top 0.254: R2.2 17.73,50.31 v18.91,51.49 | U4.29 26.6,48.16 v26.83,48.39
  Bottom 0.254: v26.83,48.39 23.73,51.49 v18.91,51.49 18.04,50.62 18.04,29.88 17.46,29.29 PROG.5
SCK  (via drill 0.35)
  Top 0.254: NRF.5 19.36,32.1 18.14,30.89 18.14,29.88 18.68,29.34 18.68,23.98 PROG.3 | v31.23,37.72 31.23,38.95 U4.17
  Bottom 0.254: NRF.5 20.63,31.65 25.15,31.65 v31.23,37.72
SCL
  Top 0.254: U4.28 27.64,46.34 27.64,46.85 28.89,48.1 OLED.3
SDA
  Top 0.254: 28.24,46.14 U4.27 28.2,46.83 29.93,48.56 29.93,52.53 29.32,53.14 28.46,53.14 27.42,52.1 OLED.4
STATUS
  Top 0.254: U1.8 28.25,28.03 U3.3
V_BATT  (via drill 0.35)
  Top 0.254: C10.1 IC1.3 | IC1.3 25.68,10.59 26.43,9.84 26.43,5.91 SW.1 | IC1.3 26.97,13.56 26.97,15.44 25.47,16.94 21.09,16.94 21.09,18.47 21.56,18.93 21.86,18.93 Q1.2 Q1.1 | Q1.5 Q1.6 | Q1.6 Q1.1 | Q1.6 U2.1 | Q1.1 21.87,21.92 v22.08,22.13 22.08,28.83 23.12,29.88 23.12,31.55 v24.24,32.67
  Bottom 0.254: v24.82,41.4 24.82,41.81 | 24.82,41.81 24.82,43.78 R7.2 | v24.24,32.67 24.24,41.23 24.82,41.81
V_USB
  Top 0.254: USB.2 28.28,9.69 IC1.4 | IC1.4 28.84,13.56 30.11,12.29 C9.1 | IC1.4 28.28,14.19 27.4,15.06 27.4,15.85 27.57,16.01 29,16.01 29.21,15.8 34.57,15.8 D1.A
  Bottom 0.254: CHARGE.3 17.41,15.14 18.63,13.92 21.9,13.92 24.05,13.92 USB.2
VIN  (via drill 0.35)
  Top 0.254: U3.1 C1.1 24.49,30.75 v24.49,29.36 | 25.85,18 25.71,18 | 25.71,18 Q1.4 | U2.6 29.15,19.48 29.01,19.48 27.96,18.43 27.96,17.94 27.29,17.26 26.59,17.26 25.85,18 | 25.85,18 25.71,18 | D1.C 33.7,18.63 R1.2 30.79,19.9 U2.6 | VR1.1 32.06,25.94 U1.7 26.75,25.94 v26.37,26.32 | U2.6 29.52,19.94 v29.52,21.52
  Bottom 0.254: v26.37,26.32 26.37,24.67 v29.52,21.52 | v29.52,21.52 29.5,21.52 | v24.49,29.36 25.76,28.09 25.76,25.3 | 25.76,25.3 25.76,25.25 | v29.52,21.52 28.28,21.52 28.25,21.49 25.76,23.98 25.76,25.3
XTAL1
  Top 0.254: U4.7 21.91,39.83 20.54,41.19 20.05,41.19 Y1.1 17.58,43.91 C6.1
XTAL2
  Top 0.254: C7.1 15.22,41.19 18.24,41.19 19.47,39.96 Y1.3 20.81,39.03 U4.8

### Text on the board
tNames: LED | -